# EAGLE design instrumentation-amplifier (EAGLE 6.4)
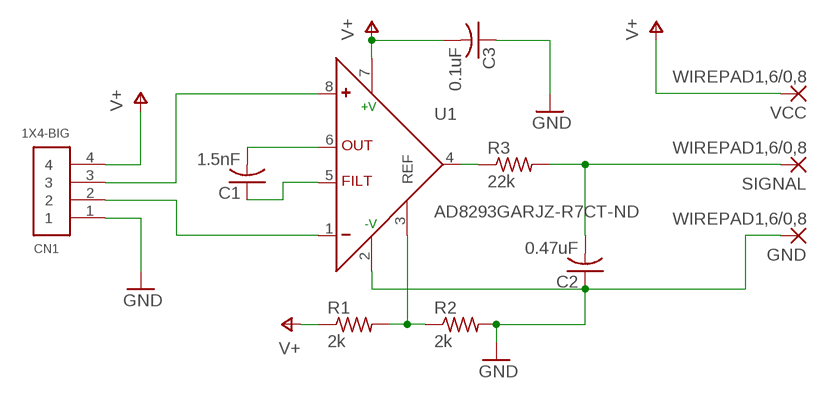
[diagram p0: schematic, sheet 1]

## Parts
C1  1.5nF  C-US025-024X044  [C025-024X044]
C2  0.47uF  C-US050-024X044  [C050-024X044]
C3  0.1uF  C-US050-024X044  [C050-024X044]
CN1  1X4-BIG  [1X04-BIG]
GND  WIREPAD1,6/0,8  [1,6/0,8]
R1  2k  R-US_R0603  [R0603]
R2  2k  R-US_R0603  [R0603]
R3  22k  R-US_R0603  [R0603]
SIGNAL  WIREPAD1,6/0,8  [1,6/0,8]
U1  AD8293GARJZ-R7CT-ND  [SOT23-8]
VCC  WIREPAD1,6/0,8  [1,6/0,8]

## Nets
GND: C2.1 C3.1 CN1.1 GND.1(P) R2.2 U1.2(-V)
N$1: C1.2 U1.6(OUT)
N$2: C1.1 U1.5(FILT)
N$3: R1.2 R2.1 U1.3(REF)
N$4: C2.2 R3.2 SIGNAL.1(P)
N$6: CN1.3 U1.8(+)
N$7: CN1.2 U1.1(-)
N$8: R3.1 U1.4(ADC-OUT)
V+: C3.2 CN1.4 R1.1 U1.7(+V) VCC.1(P)

## Library data of the parts
C1-C3 = adafruit:C-US: CAPACITOR, American symbol
CN1 = adafruit:1X4: 4-pin connector
GND SIGNAL VCC = wirepad:WIREPAD: Wire PAD connect wire on PCB
R1-R3 = adafruit:R-US_: RESISTOR, American symbol
U1 = serge:AD8293G***ARJZ-R7CT-ND

## Board
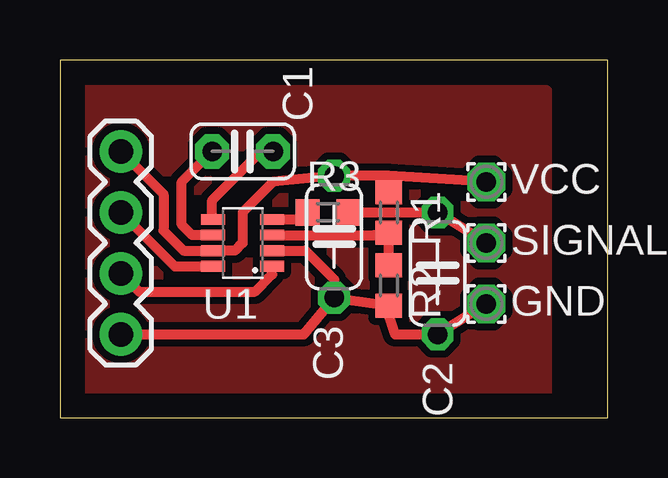
[diagram p1: board, top side]

Size 22.85 x 14.91 mm. Coordinates in mm from the lower left corner, seen from the top.
Outline: 0,14.91 0,0 22.85,0 22.85,14.91 0,14.91
Copper layers (1*16): Top 0.035mm / dielectric 1.5mm / Bottom 0.035mm
Design rules "default *": minimum track width 10mil, minimum drill 24mil, track to track 12mil, track to pad 12mil, pad to pad 12mil, via to via 12mil, smd to smd 12mil, copper to edge 40mil, drill to drill 8mil, minimum pad ring 10mil, minimum via ring 8mil, stop-mask expansion 4mil, vias tented up to drill 0mil, thermal gap 10mil

### Footprints (pad centres in the part's own frame; a part is rotated, then mirrored left to right if it is on the bottom)
C025-024X044 = drill 0.813 pad 1.422 octagon: 1 -1.27,0; 2 1.27,0
C050-024X044 = drill 0.813 octagon: 1 -2.54,0; 2 2.54,0
1X04-BIG = drill 1.016 pad 1.778: 1 0,0; 2 2.54,0; 3 5.08,0; 4 7.62,0
1,6/0,8 = drill 0.813 pad 1.6 octagon: 1 0,0
R0603 = smd 1 x 1.1: 1 -0.85,0; 2 0.85,0
SOT23-8 = smd 0.45 x 1: 1 -0.975,-1.225; 2 -0.325,-1.225; 3 0.325,-1.225; 4 0.975,-1.225; 5 0.975,1.225; 6 0.325,1.225; 7 -0.325,1.225; 8 -0.975,1.225

### Placement (x,y rotation side)
C1  7.62,11.1 180 top
C2  15.75,6.02 90 top
C3  11.43,7.54 90 top
CN1  2.54,3.48 90 top
GND  17.78,4.75 270 top
R1  13.72,8.56 270 top
R2  13.72,5.51 270 top
R3  11.18,8.56 0 top
SIGNAL  17.78,7.29 270 top
U1  AD8293G**ARJZ-R7CT-ND  [SOT23-8]  7.62,7.29 90 top
VCC  17.78,9.83 270 top

### Tracks (layer width: path | path; a pad name or v marks a point on that pad's centre or on a via)
GND
  Top 0.406: CN1.1 10.16,3.48 C3.1 | GND.1 C2.1 13.97,3.48 13.72,4.24 R2.2 13.21,4.75 C3.1 | U1.2 10.23,6.96 11.43,5.77 C3.1
N$1
  Top 0.406: C1.2 5.08,9.83 5.08,8.05 5.52,7.62 U1.6
N$2
  Top 0.406: U1.5 6.35,8.31 6.35,9.07 8.38,11.1 C1.1
N$3
  Top 0.406: R2.1 R1.2 13.11,7.62 U1.3
N$4
  Top 0.406: SIGNAL.1 C2.2 R3.2
N$5
  pour Top: 0,13.64 0,0.94 20.32,0.94 20.32,13.64
N$6
  Top 0.406: 6.05,6.31 U1.8 4.79,6.31 CN1.3
N$7
  Top 0.406: CN1.2 3.3,5.26 8.13,5.26 8.85,5.97 U1.1
N$8
  Top 0.406: U1.4 10.33,8.27 R3.1
V+
  Top 0.406: VCC.1 13.72,10.08 | 13.72,10.08 C3.2 8.89,9.83 7.62,8.56 7.62,7.29 7.29,6.96 U1.7 5.15,6.96 4.32,7.8 4.32,9.32 CN1.4 | R1.1 13.63,9.41 13.72,10.08